# Altium schematic sheet Connector.SchDoc
size A4
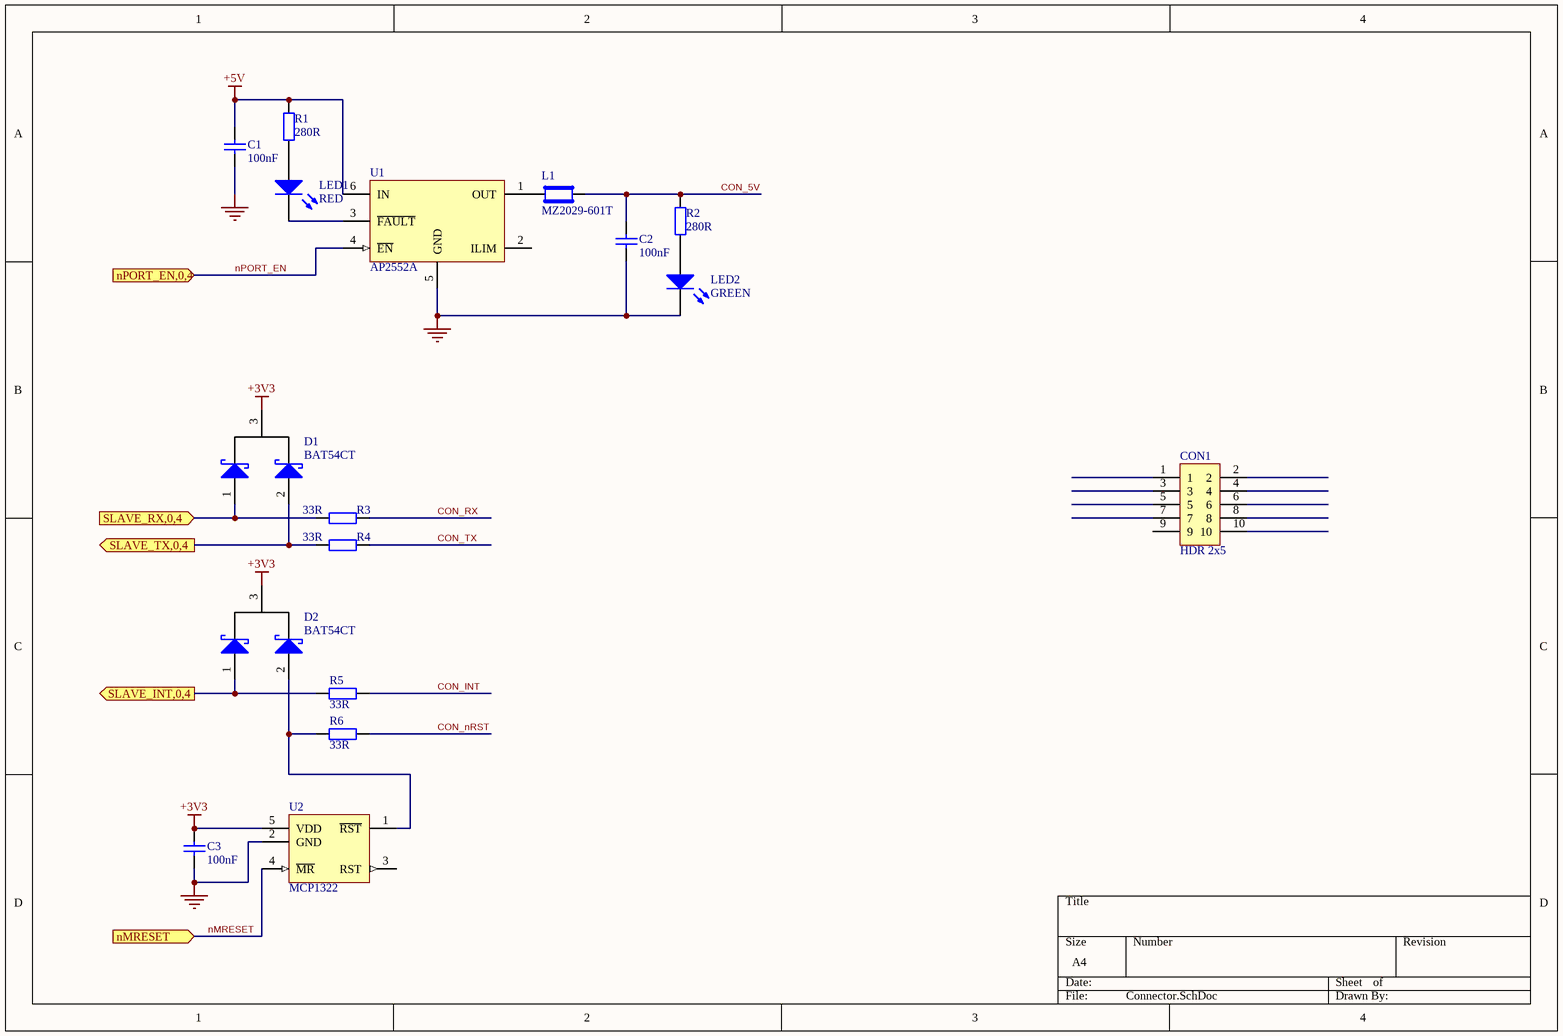
[diagram p0: Connector.SchDoc]

## Parts
C1  100nF  [C0805]
C2  100nF  [C0805]
C3  100nF  [C0805]
CON1  HDR 2x5  [SBH11-PBPC-D05-RA-BK]
D1  BAT54CT  [SOT-523]
D2  BAT54CT  [SOT-523]
L1  MZ2029-601T  [L0805]
LED1  RED  [Chipled 0805 Red]
LED2  GREEN  [Chipled 0805 Green]
R1  280R  [R0805]
R2  280R  [R0805]
R3  33R  [R0805]
R4  33R  [R0805]
R5  33R  [R0805]
R6  33R  [R0805]
U1  AP2552A  [SOT26]
U2  MCP1322  [SOT23-5]

## Ports
nMRESET (in), nPORT_EN,0,4 (in), SLAVE_INT,0,4 (out), SLAVE_RX,0,4 (in), SLAVE_TX,0,4 (out)

## Nets
+3V3: C3.2 D1.3(A) D2.3(A) U2.5(VDD)
+5V: C1.2 R1.2 U1.6(IN)
GND: C1.1 C2.1 C3.1 LED2.2(K) U1.5(GND) U2.2(GND)
CON_5V: C2.2 L1.2 R2.2
CON_INT: R5.2
CON_nRST: R6.2
CON_RX: R3.2
CON_TX: R4.2
nMRESET: U2.4(~{MR}) ; port nMRESET
nPORT_EN: U1.4(~{EN}) ; port nPORT_EN,0,4
SLAVE_INT,0,4: D2.1(K) R5.1 ; port SLAVE_INT,0,4
SLAVE_RX,0,4: D1.1(K) R3.1 ; port SLAVE_RX,0,4
SLAVE_TX,0,4: D1.2(K) R4.1 ; port SLAVE_TX,0,4
NetD2_2: D2.2(K) R6.1 U2.1(~{RST})
NetL1_1: L1.1 U1.1(OUT)
NetLED1_1: LED1.1(A) R1.1
NetLED1_2: LED1.2(K) U1.3(~{FAULT})
NetLED2_1: LED2.1(A) R2.1

Not connected (* = marked no-connect by the designer): CON1 1 2 3 4 5 6 7 8 9 10; U1 2(ILIM); U2 3(RST)

## Library data of the parts
C1-C3 = C0805C104K5RACTU: CAP CER 0.1UF 50V 10% X7R 0805; Manufacturer: Kemet; Capacitance: 0.1µF; Part Number: C0805C104K5RACTU; Value: 100nF; Supplier 1: Digi-Key; Supplier Part Number 1: 399-1170-1-ND; Manufacturer Part Number: C0805C104K5RACTU; RoHS: RoHS Compliant; Category: Capacitors; Stock 1: 3780914; Pricing 1: 1=0.1, 10=0.048, 25=0.034, 50=0.026, 100=0.0219, 250=0.018, 1000=0.01176 (EUR); Packaging: Cut Tape (CT); Tolerance: ±10%; Voltage - Rated: 50V; Temperature Coefficient: X7R; Mounting Type: Surface Mount, MLCC; Operating Temperature: -55°C ~ 125°C; Applications: General Purpose; Ratings: -; Package / Case: 0805 (2012 Metric); Size / Dimension: 0.079" L x 0.049" W (2.00mm x 1.25mm); Height - Seated (Max): -; Thickness (Max): 0.035" (0.88mm); Lead Spacing: -; Features: -; Lead Style: -; ComponentLink1URL: http://www.kemet.com/docfinder?Partnumber=C0805C104K5RACTU; ComponentLink1Description: http://www.kemet.com/docfinder?Partnumber=C0805C104K5RACTU
CON1 = SBH11-PBPC-D05-RA-BK: CONN HEADR 2.54MM 10POS GOLD R/A; Manufacturer: Sullins Connector Solutions; Connector Type: Header; Number of Positions: 10; Number of Positions Loaded: All; Current Rating: 3A; Pitch - Mating: 0.100" (2.54mm); Shrouding: Shrouded - 4 Wall; Style: Board to Board or Cable; Contact Length - Post: 0.126" (3.20mm); Material Flammability Rating: UL94 V-0; Mated Stacking Heights: 9.65mm, 11.2mm, 13.35mm, 18.35mm; Part Number: SBH11-PBPC-D05-RA-BK; Value: HDR 2x5; Supplier 1: Digi-Key; Supplier Part Number 1: S9177-ND; Manufacturer Part Number: SBH11-PBPC-D05-RA-BK; RoHS: RoHS Compliant; Category: Connectors, Interconnects; Stock 1: 16639; Pricing 1: 1=0.78, 10=0.61, 25=0.5688, 50=0.517, 100=0.4652, 250=0.3928, 500=0.37212, 1000=0.33078, 2500=0.27496 (EUR); Packaging: Tray; Contact Type: Male Pin; Number of Rows: 2; Mounting Type: Through Hole, Right Angle; Termination: Solder; Fastening Type: -; Features: Keying Slot; ComponentLink1URL: http://sullinscorp.com/catalogs/145_PAGE118_.100_SBH11_SERIES_MALE_BOX_HDR_ST_RA_SMT.pdf; ComponentLink1Description: http://sullinscorp.com/catalogs/145_PAGE118_.100_SBH11_SERIES_MALE_BOX_HDR_ST_RA_SMT.pdf; Voltage Rating: -; Contact Material: Brass; Operating Temperature: -40°C ~ 105°C; Part Status: Active; Row Spacing - Mating: 0.100" (2.54mm); Contact Length - Mating: -; Contact Finish - Mating: Gold; Contact Finish Thickness - Mating: Flash; Insulation Color: Black; Overall Contact Length: -; Insulation Height: 0.358" (9.10mm); Contact Shape: Square; Ingress Protection: -; Contact Finish - Post: Gold; Insulation Material: Polybutylene Terephthalate (PBT); Contact Finish Thickness - Post: Flash; Applications: -
D1 D2 = BAT54CT-7-F: DIODE ARRAY SCHOTTKY 30V SOT523; Manufacturer: Diodes Incorporated; Current - Reverse Leakage @ Vr: 2µA @ 25V; Voltage - Forward (Vf) (Max) @ If: 1V @ 100mA; Speed: Small Signal =< 200mA (Io), Any Speed; Reverse Recovery Time (trr): 5ns; Diode Configuration: 1 Pair Common Cathode; Current - Average Rectified (Io) (per Diode): 200mA (DC); Part Number: BAT54CT-7-F; Value: BAT54CT; Supplier 1: Digi-Key; Supplier Part Number 1: BAT54CT-FDICT-ND; Manufacturer Part Number: BAT54CT-7-F; RoHS: RoHS Compliant; Category: Discrete Semiconductor Products; Stock 1: 22; Pricing 1: 1=0.44, 10=0.327, 100=0.185, 500=0.12252, 1000=0.09393 (EUR); Packaging: Cut Tape (CT); Mounting Type: Surface Mount; Package / Case: SOT-523; Supplier Device Package: SOT-523; ComponentLink1URL: http://www.diodes.com/_files/datasheets/ds30259.pdf; ComponentLink1Description: http://www.diodes.com/_files/datasheets/ds30259.pdf; Diode Type: Schottky; Voltage - DC Reverse (Vr) (Max): 30V; Operating Temperature - Junction: -65°C ~ 125°C; Part Status: Active
L1 = MZ2029-601T: FERRITE BEAD 600 OHM 0805 1LN; Manufacturer: Bourns Inc.; Filter Type: Power, Signal Line; Number of Lines: 1; Impedance @ Frequency: 600 Ohm @ 100MHz; Current Rating (Max): 200mA; DC Resistance (DCR) (Max): 400 mOhm; Part Number: MZ2029-601T; Value: MZ2029-601T; Supplier 1: Digi-Key; Supplier Part Number 1: MZ2029-601TCT-ND; Manufacturer Part Number: MZ2029-601T; RoHS: RoHS Compliant; Category: Filters; Stock 1: 3765; Pricing 1: 1=0.09, 10=0.064, 25=0.058, 50=0.0522, 100=0.0383, 250=0.02788, 500=0.02554, 1000=0.02206 (EUR); Packaging: Cut Tape (CT); Part Status: Active; Ratings: -; Operating Temperature: -55°C ~ 125°C; Package / Case: 0805 (2012 Metric); Mounting Type: Surface Mount; Height (Max): 0.043" (1.10mm); Size / Dimension: 0.079" L x 0.047" W (2.00mm x 1.20mm); ComponentLink1URL: http://www.bourns.com/docs/Product-Datasheets/mgmumz.pdf; ComponentLink1Description: http://www.bourns.com/docs/Product-Datasheets/mgmumz.pdf
LED1 = LH R974-LP-1: LED RED DIFFUSED 0805 SMD; Manufacturer: OSRAM Opto Semiconductors Inc.; Voltage - Forward (Vf) (Typ): 1.8V; Viewing Angle: 160°; Wavelength - Dominant: 645nm; Wavelength - Peak: 660nm; Millicandela Rating: 41mcd; Current - Test: 20mA; Lens Color: White; Lens Style/Size: Rectangle with Flat Top, 1.30mm x 1.25mm; Part Number: LH R974-LP-1; Value: RED; Supplier 1: Digi-Key; Supplier Part Number 1: 475-1415-1-ND; Manufacturer Part Number: LH R974-LP-1; RoHS: RoHS Compliant; Category: Optoelectronics; Stock 1: 61403; Pricing 1: 1=0.24, 10=0.187, 25=0.1624, 100=0.1024, 250=0.06828, 500=0.05804, 1000=0.04437 (EUR); Packaging: Cut Tape (CT); Mounting Type: Surface Mount; Package / Case: 0805 (2012 Metric); ComponentLink1URL: http://www.osram-os.com/Graphics/XPic8/00078869_0.pdf; ComponentLink1Description: http://www.osram-os.com/Graphics/XPic8/00078869_0.pdf; Supplier Device Package: *; Color: Red; Lens Transparency: Diffused; Size / Dimension: 2.00mm L x 1.25mm W; Height (Max): 0.90mm
LED2 = LG R971-KN-1: LED GREEN DIFFUSED 0805 SMD; Manufacturer: OSRAM Opto Semiconductors Inc.; Voltage - Forward (Vf) (Typ): 2.2V; Viewing Angle: 160°; Wavelength - Dominant: 570nm; Wavelength - Peak: 572nm; Millicandela Rating: 26.05mcd; Current - Test: 20mA; Lens Color: White; Lens Style/Size: Rectangle with Flat Top, 1.30mm x 1.25mm; Part Number: LG R971-KN-1; Value: GREEN; Supplier 1: Digi-Key; Supplier Part Number 1: 475-1410-1-ND; Manufacturer Part Number: LG R971-KN-1; RoHS: RoHS Compliant; Category: Optoelectronics; Stock 1: 203153; Pricing 1: 1=0.24, 10=0.187, 25=0.1624, 100=0.1024, 250=0.06828, 500=0.05804, 1000=0.04437 (EUR); Packaging: Cut Tape (CT); Mounting Type: Surface Mount; Package / Case: 0805 (2012 Metric); ComponentLink1URL: http://www.osram-os.com/Graphics/XPic9/00078860_0.pdf; ComponentLink1Description: http://www.osram-os.com/Graphics/XPic9/00078860_0.pdf; Supplier Device Package: *; Color: Green; Lens Transparency: Diffused; Size / Dimension: 2.00mm L x 1.25mm W; Height (Max): 0.90mm; Features: -
R1 R2 = RC0805FR-07280RL: RES SMD 280 OHM 1% 1/8W 0805; Manufacturer: Yageo; Resistance (Ohms): 280; Power (Watts): 0.125W, 1/8W; Temperature Coefficient: ±100ppm/°C; Part Number: RC0805FR-07280RL; Value: 280R; Manufacturer Part Number: RC0805FR-07280RL; RoHS: RoHS Compliant; Category: Resistors; Stock 1: 13054; Pricing 1: 1=0.09, 10=0.018, 25=0.0128, 50=0.0098, 100=0.0073, 250=0.00552, 500=0.00442, 1000=0.00326 (EUR); Packaging: Cut Tape (CT); Tolerance: ±1%; Composition: Thick Film; Features: Moisture Resistant; Operating Temperature: -55°C ~ 155°C; Package / Case: 0805 (2012 Metric); Supplier Device Package: 0805; Size / Dimension: 0.079" L x 0.049" W (2.00mm x 1.25mm); ComponentLink1URL: http://www.yageo.com/documents/recent/PYu-RC_Group_51_RoHS_L_6.pdf; ComponentLink1Description: http://www.yageo.com/documents/recent/PYu-RC_Group_51_RoHS_L_6.pdf; Supplier 1: Digi-Key; Supplier Part Number 1: 311-280CRCT-ND; Height - Seated (Max): 0.024" (0.60mm); Part Status: Active; Failure Rate: -
R3-R6 = RC0805JR-0733RL: RES SMD 33 OHM 5% 1/8W 0805; Manufacturer: Yageo; Resistance (Ohms): 33; Power (Watts): 0.125W, 1/8W; Temperature Coefficient: ±100ppm/°C; Part Number: RC0805JR-0733RL; Value: 33R; Manufacturer Part Number: RC0805JR-0733RL; RoHS: RoHS Compliant; Category: Resistors; Stock 1: 107005; Pricing 1: 1=0.09, 10=0.015, 25=0.0108, 50=0.0084, 100=0.0062, 250=0.00476, 500=0.00382, 1000=0.0028 (EUR); Packaging: Cut Tape (CT); Tolerance: ±5%; Composition: Thick Film; Features: Moisture Resistant; Operating Temperature: -55°C ~ 155°C; Package / Case: 0805 (2012 Metric); Supplier Device Package: 0805; Size / Dimension: 0.079" L x 0.049" W (2.00mm x 1.25mm); ComponentLink1URL: http://www.yageo.com/documents/recent/PYu-RC_Group_51_RoHS_L_6.pdf; ComponentLink1Description: http://www.yageo.com/documents/recent/PYu-RC_Group_51_RoHS_L_6.pdf; Supplier 1: Digi-Key; Supplier Part Number 1: 311-33ARCT-ND; Height - Seated (Max): 0.024" (0.60mm); Part Status: Active; Failure Rate: -
U1 = AP2552AW6-7: IC PD SW CURR LIMIT SOT26; Manufacturer: Diodes Incorporated; Switch Type: General Purpose; Number of Outputs: 1; Output Configuration: High Side; Output Type: P-Channel; Interface: On/Off; Voltage - Load: 2.7 V ~ 5.5 V; Voltage - Supply (Vcc/Vdd): Not Required; Current - Output (Max): 2.1A; Rds On (Typ): 70 mOhm; Input Type: Non-Inverting; Fault Protection: Current Limiting (Adjustable), Over Temperature, Reverse Current, UVLO; Part Number: AP2552AW6-7; Value: AP2552A; Supplier 1: Digi-Key; Supplier Part Number 1: AP2552AW6-7DICT-ND; Manufacturer Part Number: AP2552AW6-7; RoHS: RoHS Compliant; Category: Integrated Circuits (ICs); Stock 1: 1661; Pricing 1: 1=0.47, 10=0.401, 100=0.2994, 500=0.2353, 1000=0.18182 (EUR); Packaging: Cut Tape (CT); Features: Load Discharge, Status Flag; Operating Temperature: -40°C ~ 125°C (TJ); Package / Case: SOT-23-6; Supplier Device Package: SOT-26; ComponentLink1URL: http://www.diodes.com/_files/datasheets/AP255x.pdf; ComponentLink1Description: http://www.diodes.com/_files/datasheets/AP255x.pdf; Part Status: Active
U2 = MCP1322T-46LE/OT: IC SUPERVISOR 4.6V SOT23-5; Manufacturer: Microchip Technology; Output: Open Drain, Push-Pull; Reset: Active High/Active Low; Reset Timeout: 140 ms Minimum; Part Number: MCP1322T-46LE/OT; Value: MCP1322; Supplier 1: Digi-Key; Supplier Part Number 1: MCP1322T-46LE/OTCT-ND; Manufacturer Part Number: MCP1322T-46LE/OT; RoHS: RoHS Compliant; Category: Integrated Circuits (ICs); Stock 1: 5889; Pricing 1: 1=0.58, 25=0.4764, 100=0.4375 (EUR); Packaging: Cut Tape (CT); Part Status: Active; Operating Temperature: -40°C ~ 125°C (TA); Mounting Type: Surface Mount; Package / Case: SC-74A, SOT-753; Supplier Device Package: SOT-23-5; ComponentLink1URL: http://www.microchip.com/mymicrochip/filehandler.aspx?ddocname=en025429; ComponentLink1Description: http://www.microchip.com/mymicrochip/filehandler.aspx?ddocname=en025429; Type: Simple Reset/Power-On Reset; Voltage - Threshold: 4.6V